# EAGLE design Emulator (EAGLE 9.6.2)

## Sheet 1 of 3: MCU
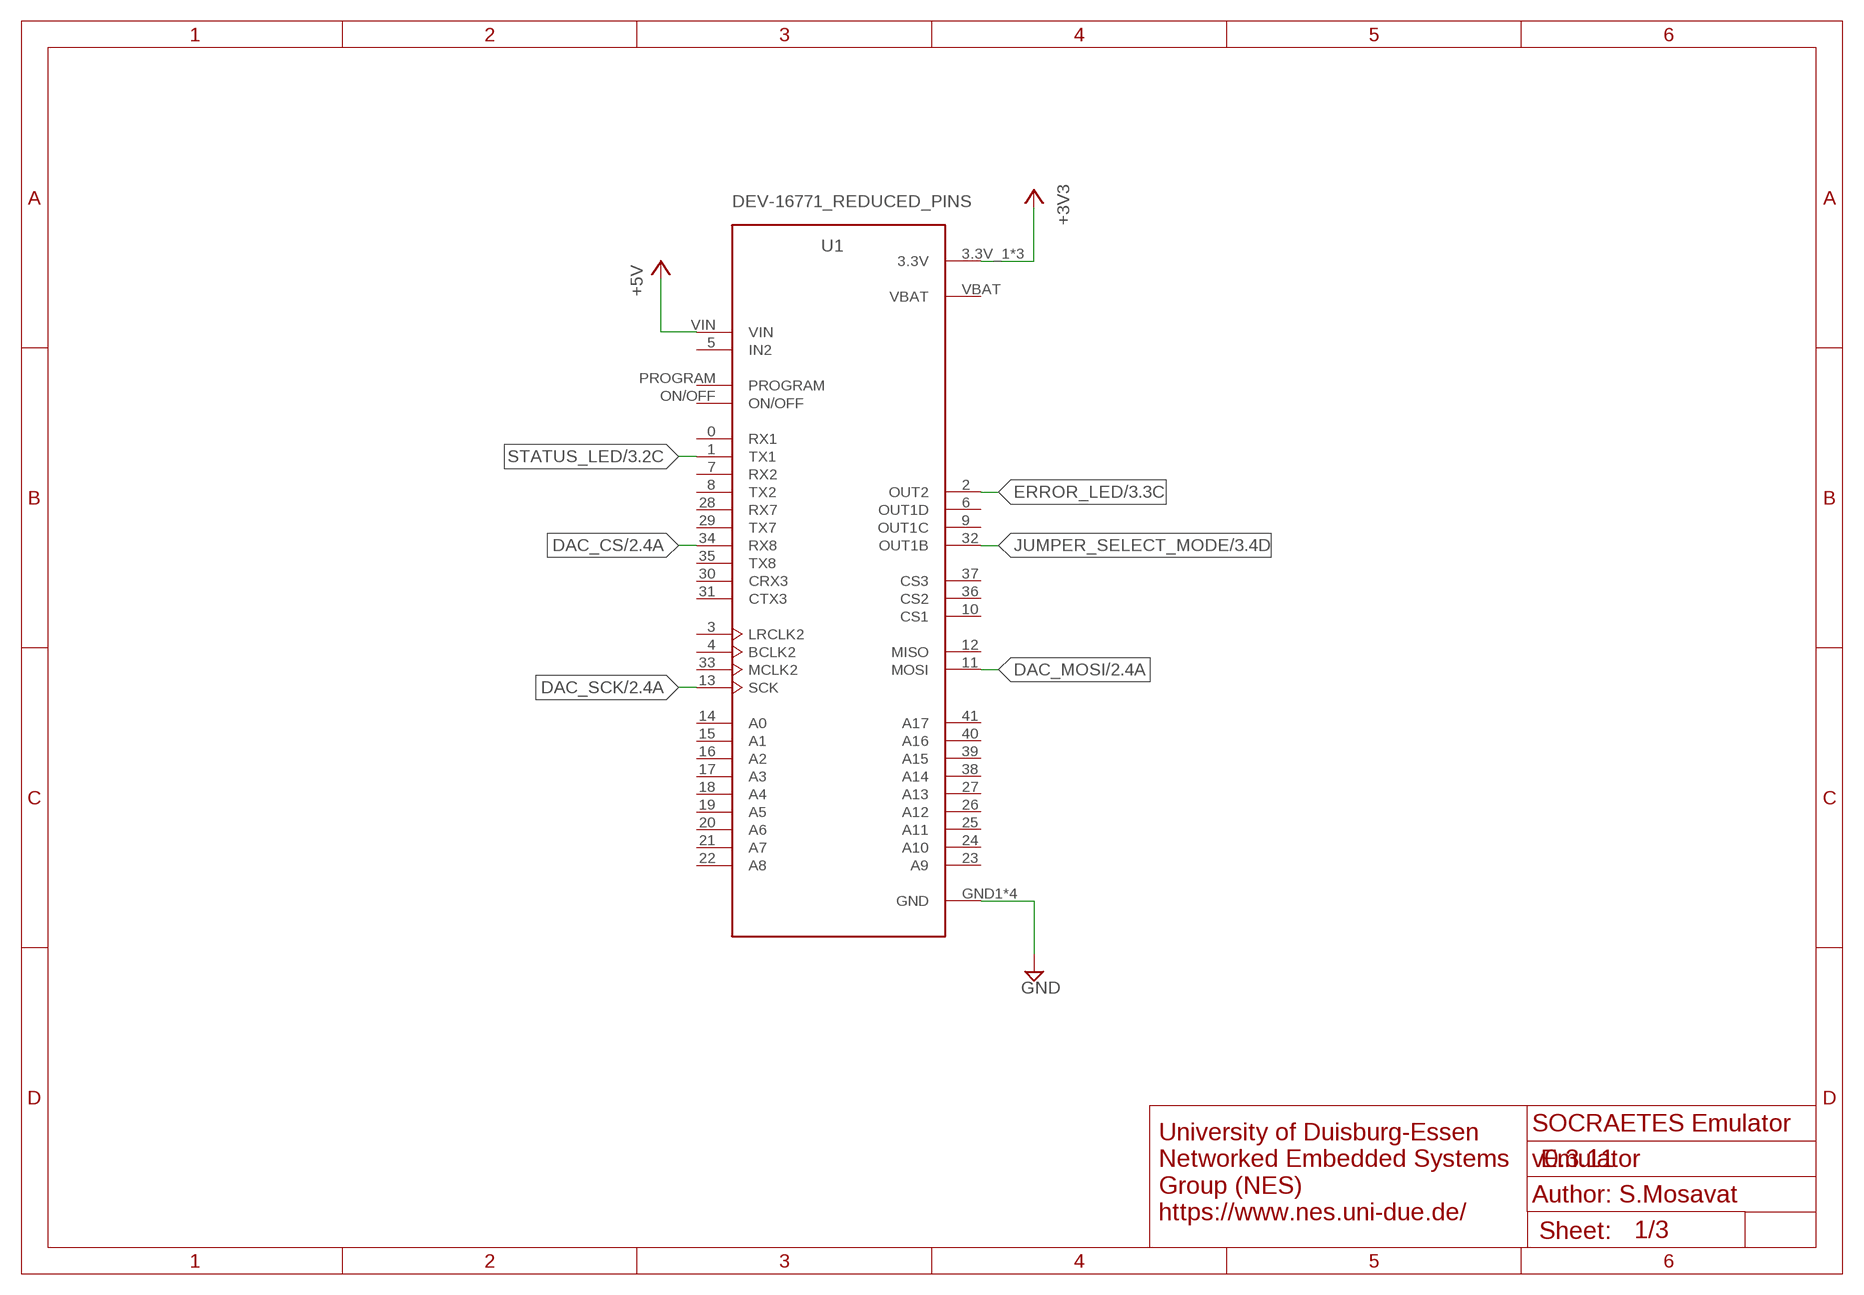
[diagram p0: schematic, sheet 1]

### Parts
U1  DEV-16771_REDUCED_PINS  [MODULE_DEV-16771_REDUCED_PINS]

### Nets
+3V3: U1.3.3V_1(3.3V) U1.3.3V_2(3.3V) U1.3.3V_3(3.3V) ; also sheet 3
+5V: U1.VIN ; also sheet 2,3
DAC_CS: U1.34(RX8) ; also sheet 2
DAC_MOSI: U1.11(MOSI) ; also sheet 2
DAC_SCK: U1.13(SCK) ; also sheet 2
ERROR_LED: U1.2(OUT2) ; also sheet 3
GND: U1.GND1(GND) U1.GND2(GND) U1.GND3(GND) U1.GND4(GND) ; also sheet 2,3
JUMPER_SELECT_MODE: U1.32(OUT1B) ; also sheet 3
STATUS_LED: U1.1(TX1) ; also sheet 3
Unconnected: U1.0(RX1) U1.3(LRCLK2) U1.4(BCLK2) U1.5(IN2) U1.6(OUT1D) U1.7(RX2) U1.8(TX2) U1.9(OUT1C) U1.10(CS1) U1.12(MISO) U1.14(A0) U1.15(A1) U1.16(A2) U1.17(A3) U1.18(A4) U1.19(A5) U1.20(A6) U1.21(A7) U1.22(A8) U1.23(A9) U1.24(A10) U1.25(A11) U1.26(A12) U1.27(A13) U1.28(RX7) U1.29(TX7) U1.30(CRX3) U1.31(CTX3) U1.33(MCLK2) U1.35(TX8) U1.36(CS2) U1.37(CS3) U1.38(A14) U1.39(A15) U1.40(A16) U1.41(A17) U1.ON/OFF U1.PROGRAM U1.VBAT

### Notes on the sheet
- SOCRAETES Emulator
- v0.3.11
- Author: S.Mosavat
- University of Duisburg-Essen
  Networked Embedded Systems
  Group (NES)
  https://www.nes.uni-due.de/

## Sheet 2 of 3: Analog front-end
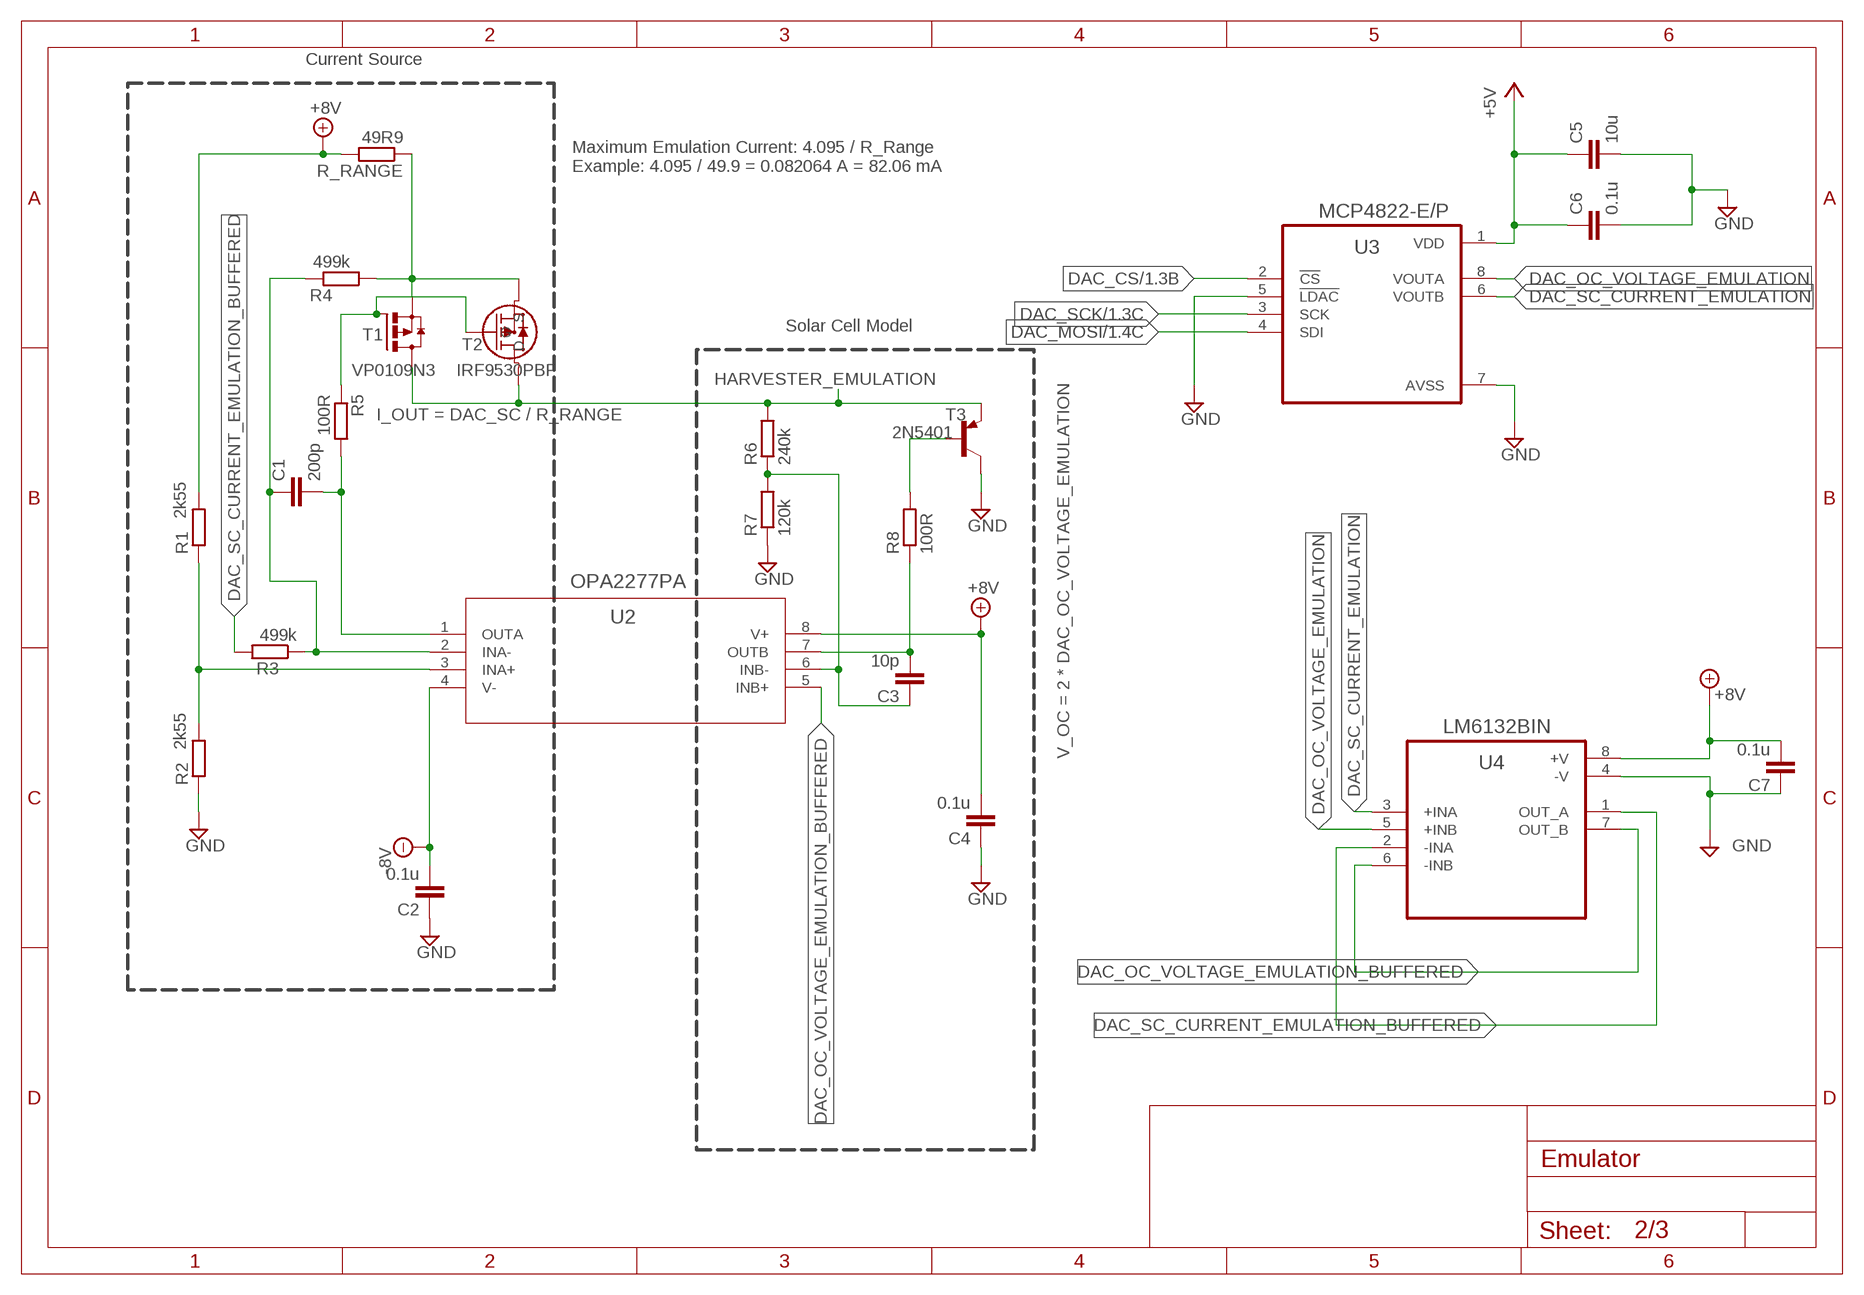
[diagram p1: schematic, sheet 2]

### Parts
C1  200p  C-EU025-024X044  [C025-024X044]
C2  0.1u  C-EU025-024X044  [C025-024X044]
C3  10p  C-EU025-024X044  [C025-024X044]
C4  0.1u  C-EU025-024X044  [C025-024X044]
C5  10u  C-EU025-024X044  [C025-024X044]
C6  0.1u  C-EU025-024X044  [C025-024X044]
C7  0.1u  C-EU025-024X044  [C025-024X044]
R1  2k55  R-EU_0207/10  [0207/10]
R2  2k55  R-EU_0207/10  [0207/10]
R3  499k  R-EU_0207/10  [0207/10]
R4  499k  R-EU_0207/10  [0207/10]
R5  100R  R-EU_0207/10  [0207/10]
R6  240k  R-EU_0207/10  [0207/10]
R7  120k  R-EU_0207/10  [0207/10]
R8  100R  R-EU_0207/10  [0207/10]
R_RANGE  49R9  R-EU_0207/10  [0207/10]
T1  VP0109N3  [TO92-SGD]
T2  IRF9530PBF  [TO220AB_VIS]
T3  2N5401  2N5401-PNP-TO92-EBC  [TO92-EBC]
U2  OPA2277PA  [P8]
U3  MCP4822-E/P  [DIP787W46P254L927H533Q8]
U4  LM6132BIN  [DIP794W45P254L959H508Q8]

### Nets
+5V: C5.1 C6.1 U3.1(VDD) ; also sheet 1,3
+8V: C4.2 C7.2 R1.2 R_RANGE.2 U2.8(V+) U4.8(+V) ; also sheet 3
-8V: C2.2 U2.4(V-) ; also sheet 3
DAC_CS: U3.2(!CS) ; also sheet 1
DAC_MOSI: U3.4(SDI) ; also sheet 1
DAC_OC_VOLTAGE_EMULATION: U3.8(VOUTA) U4.5(+INB)
DAC_OC_VOLTAGE_EMULATION_BUFFERED: U2.5(INB+) U4.6(-INB) U4.7(OUT_B)
DAC_SC_CURRENT_EMULATION: U3.6(VOUTB) U4.3(+INA)
DAC_SC_CURRENT_EMULATION_BUFFERED: R3.2 U4.1(OUT_A) U4.2(-INA)
DAC_SCK: U3.3(SCK) ; also sheet 1
GND: C2.1 C4.1 C5.2 C6.2 C7.1 R2.1 R7.1 T3.C U3.5(!LDAC) U3.7(AVSS) U4.4(-V) ; also sheet 1,3
HARVESTER_EMULATION: R6.2 T1.DRAIN(D) T2.D T3.E ; also sheet 3
N$1: R1.1 R2.2 U2.3(INA+)
N$3: C1.1 R3.1 R4.2 U2.2(INA-)
N$5: R5.1 T1.GATE(G) T2.G
N$6: C1.2 R5.2 U2.1(OUTA)
N$7: R4.1 R_RANGE.1 T1.SOURCE(S) T2.S
N$11: C3.1 R6.1 R7.2 U2.6(INB-)
N$12: R8.2 T3.B
N$13: C3.2 R8.1 U2.7(OUTB)

### Notes on the sheet
- Current Source
- Maximum Emulation Current: 4.095 / R_Range
  Example: 4.095 / 49.9 = 0.082064 A = 82.06 mA
- Solar Cell Model
- I_OUT = DAC_SC / R_RANGE
- V_OC = 2 * DAC_OC_VOLTAGE_EMULATION

## Sheet 3 of 3: Power
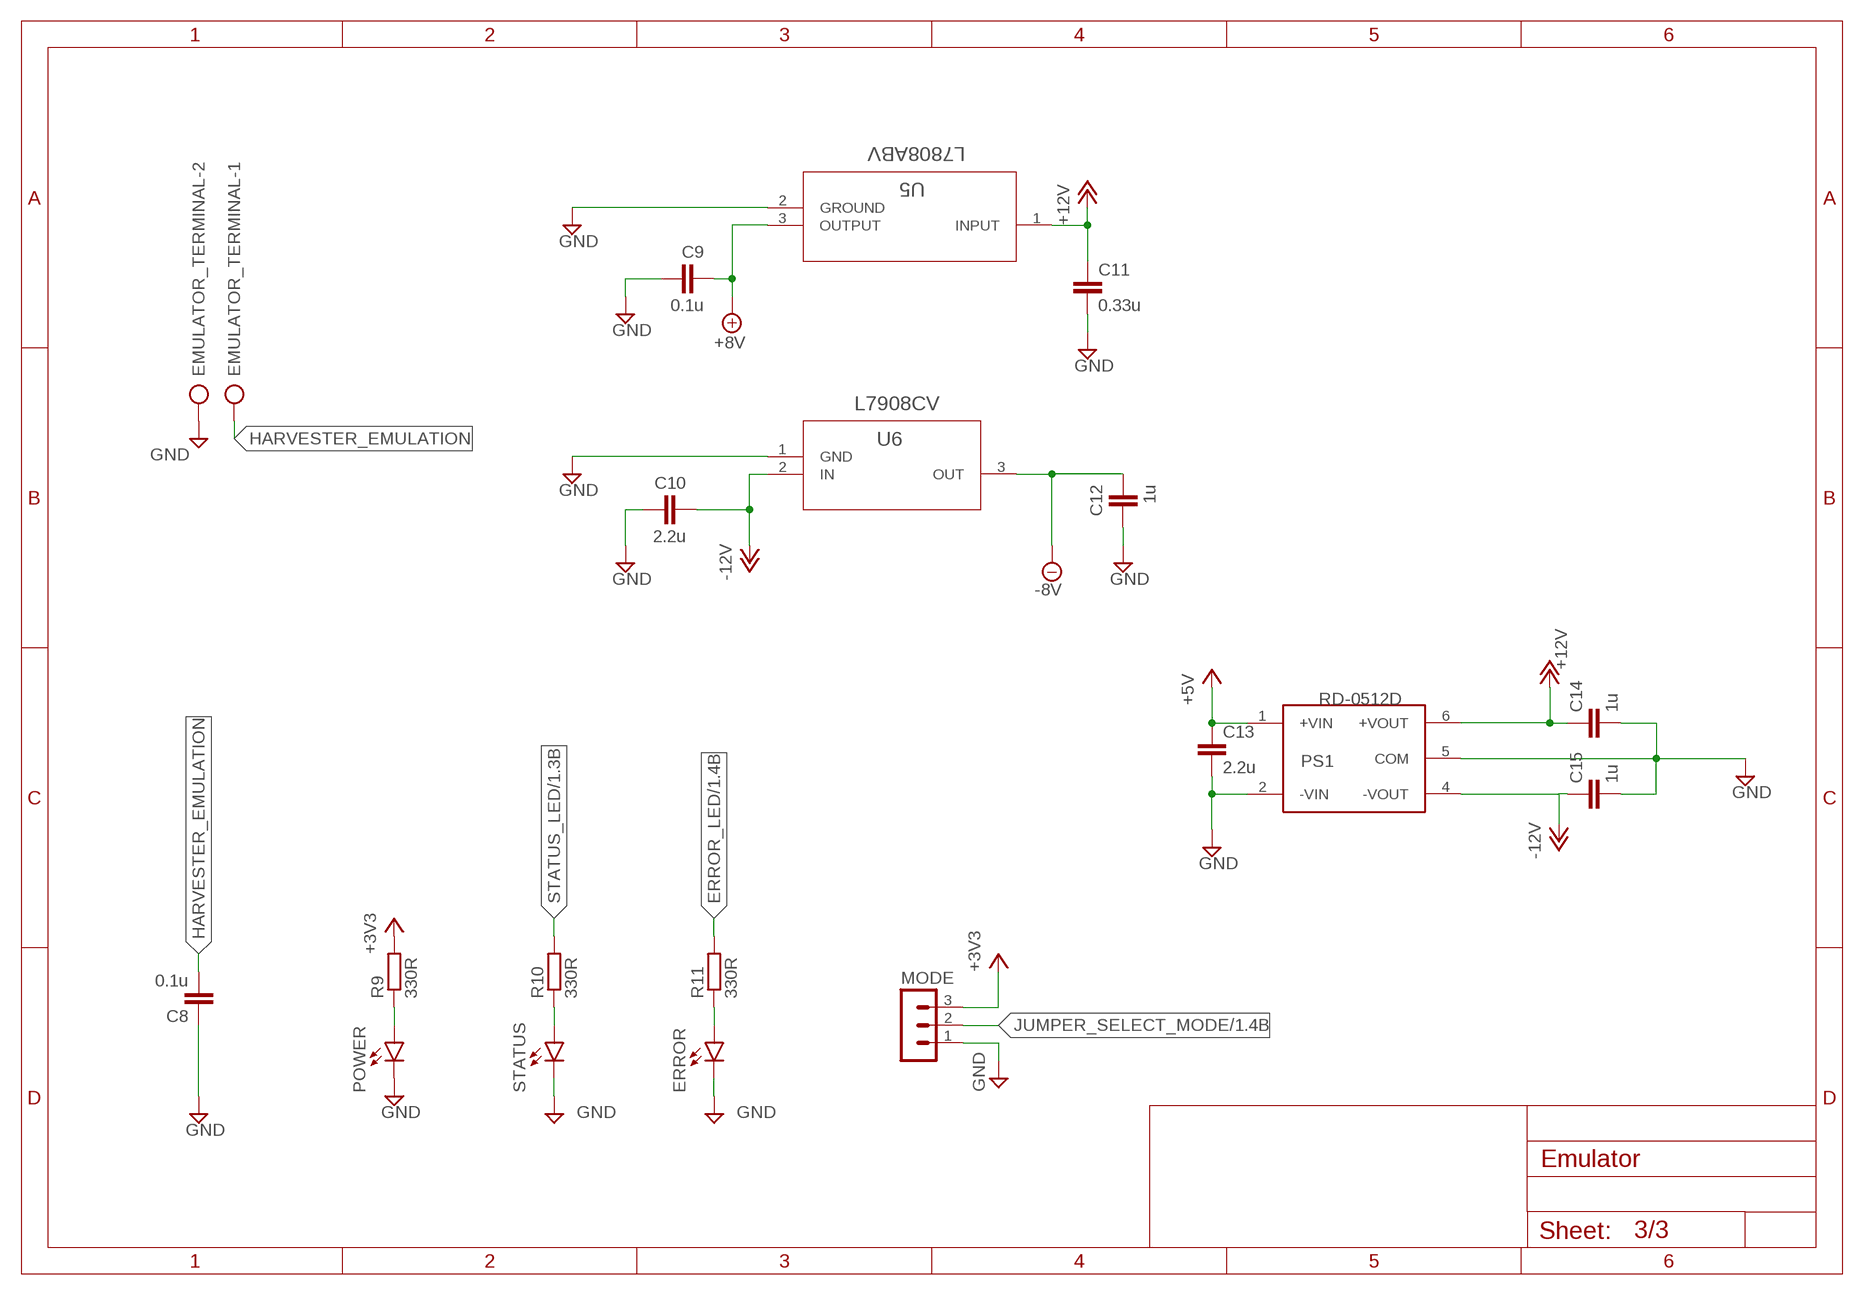
[diagram p2: schematic, sheet 3]

### Parts
C8  0.1u  C-EU025-024X044  [C025-024X044]
C9  0.1u  C-EU025-024X044  [C025-024X044]
C10  2.2u  C-EU025-024X044  [C025-024X044]
C11  0.33u  C-EU025-024X044  [C025-024X044]
C12  1u  C-EU025-024X044  [C025-024X044]
C13  2.2u  C-EU025-024X044  [C025-024X044]
C14  1u  C-EU025-024X044  [C025-024X044]
C15  1u  C-EU025-024X044  [C025-024X044]
EMULATOR_TERMINAL  AK300/2  [AK300/2]
ERROR  LED5MM  [LED5MM]
MODE  MA03-1  [MA03-1]
POWER  LED5MM  [LED5MM]
PS1  RD-0512D  [CONV_RD-0512D]
R9  330R  R-EU_0207/10  [0207/10]
R10  330R  R-EU_0207/10  [0207/10]
R11  330R  R-EU_0207/10  [0207/10]
STATUS  LED5MM  [LED5MM]
U5  L7808ABV  [TO-220_STM]
U6  L7908CV  [TO-220_STM]

### Nets
+3V3: MODE.3 R9.2 ; also sheet 1
+5V: C13.1 PS1.1(+VIN) ; also sheet 1,2
+8V: C9.2 U5.3(OUTPUT) ; also sheet 2
+12V: C11.1 C14.1 PS1.6(+VOUT) U5.1(INPUT)
-8V: C12.2 U6.3(OUT) ; also sheet 2
-12V: C10.2 C15.1 PS1.4(-VOUT) U6.2(IN)
ERROR_LED: R11.2 ; also sheet 1
GND: C8.1 C9.1 C10.1 C11.2 C12.1 C13.2 C14.2 C15.2 EMULATOR_TERMINAL.2 ERROR.K(C) MODE.1 POWER.K(C) PS1.2(-VIN) PS1.5(COM) STATUS.K(C) U5.2(GROUND) U6.1(GND) ; also sheet 1,2
HARVESTER_EMULATION: C8.2 EMULATOR_TERMINAL.1 ; also sheet 2
JUMPER_SELECT_MODE: MODE.2 ; also sheet 1
N$2: R10.1 STATUS.A
N$4: ERROR.A R11.1
N$9: POWER.A R9.1
STATUS_LED: R10.2 ; also sheet 1

## Library data of the parts
C1-C15 = rcl:C-EU: CAPACITOR, European symbol; SPICEPREFIX: C
EMULATOR_TERMINAL = con-ptr500:AK300/2: CONNECTOR; OC_FARNELL: unknown; OC_NEWARK: unknown
ERROR POWER STATUS = led:LED: LED OSRAM: - CHIPLED LG R971, LG N971, LY N971, LG Q971, LY Q971, LO R971, LY R971 LH N974, LH R974 LS Q976, LO Q976, LY Q976 LO Q996 - Hyper CHIPLED LW Q18S LB Q993, LB Q99A, LB R99A - SideLED LS A670, LO A670, LY A670, LG A670, LP A670 LB A673, LV A673, LT A673, LW A673 LH A674 LY A675 LS A676, LA A676, LO A676, LY A676, LW A676 LS A679, LY A679, LG A679 - Hyper Micro SIDELED® LS Y876, LA Y876, LO Y876, LY Y876 LT Y87S - SmartLED LW L88C, LW L88S LB L89C, LB L89S, LG L890 LS L89K, LO L89K, LY L89K LS L896, LA L896, LO L896, LY L896 - TOPLED LS T670, LO T670, LY T670, LG T670, LP T670 LSG T670, LSP T670, LSY T670, LOP T670, LYG T670 LG T671, LOG T671, LSG T671 LB T673, LV T673, LT T673, LW T673 LH T674 LS T676, LA T676, LO T676, LY T676, LB T676, LH T676, LSB T676, LW T676 LB T67C, LV T67C, LT T67C, LS T67K, LO T67K, LY T67K, LW E67C LS E67B, LA E67B, LO E67B, LY E67B, LB E67C, LV E67C, LT E67C LW T67C LS T679, LY T679, LG T679 LS T770, LO T770, LY T770, LG T770, LP T770 LB T773, LV T773, LT T773, LW T773 LH T774 LS E675, LA E675, LY E675, LS T675 LS T776, LA T776, LO T776, LY T776, LB T776 LHGB T686 LT T68C, LB T68C - Hyper Mini TOPLED® LB M676 - Mini TOPLED Santana® LG M470 LS M47K, LO M47K, LY M47K Source: http://www.osram.convergy.de LUXEON: - LUMILED® LXK2-PW12-R00, LXK2-PW12-S00, LXK2-PW14-U00, LXK2-PW14-V00 LXK2-PM12-R00, LXK2-PM12-S00, LXK2-PM14-U00 LXK2-PE12-Q00, LXK2-PE12-R00, LXK2-PE12-S00, LXK2-PE14-T00, LXK2-PE14-U00 LXK2-PB12-K00, LXK2-PB12-L00, LXK2-PB12-M00, LXK2-PB14-N00, LXK2-PB14-P00, LXK2-PB14-Q00 LXK2-PR12-L00, LXK2-PR12-M00, LXK2-PR14-Q00, LXK2-PR14-R00 LXK2-PD12-Q00, LXK2-PD12-R00, LXK2-PD12-S00 LXK2-PH12-R00, LXK2-PH12-S00 LXK2-PL12-P00, LXK2-PL12-Q00, LXK2-PL12-R00 Source: www.luxeon.com KINGBRIGHT: KA-3528ASYC Source: www.kingbright.com
MODE = con-lstb:MA03-1: PIN HEADER; OC_FARNELL: unknown; OC_NEWARK: unknown
PS1 = RD-0512D:RD-0512D: 2 Watt SIP7 Dual Output Check availability <https://pricing.snapeda.com/parts/RD-0512D/Recom%20Power/view-part?ref=eda>; AVAILABILITY: In Stock; DESCRIPTION: 2W DC/DC-Converter 'ECONOLINE' SIP7 1kV unreg; MF: Recom Power; MP: RD-0512D; PACKAGE: SIP-7 Recom Power; PRICE: None; PURCHASE-URL: https://pricing.snapeda.com/search/part/RD-0512D/?ref=eda
R1-R11 R_RANGE = rcl:R-EU_: RESISTOR, European symbol; SPICEPREFIX: R
T1 = ZVP2106A:VP0109N3
T2 = IRF9530PBF:IRF9530PBF; COPYRIGHT: Copyright (C) 2023 Ultra Librarian. All rights reserved.; DIGIKEY_PART_NUMBER_1: IRF9530PBF-ND; MANUFACTURER_PART_NUMBER: IRF9530PBF; MFR_NAME: Vishay
T3 = transistor-neu-to92:*-PNP-: PNP Transistror
U1 = DEV-16771 (Teensy 41):DEV-16771_REDUCED_PINS: RT1062 Teensy 4.1 i.MX ARM Cortex-M7 MPU Embedded Evaluation Board Check availability <https://pricing.snapeda.com/parts/DEV-16771/SparkFun%20Electronics/view-part?ref=eda>
U2 = OPA2277PA:OPA2277PA; DATASHEET_URL: http://www.ti.com/lit/gpn/OPA2277; DESCRIPTION: High Precision Operational Amplifiers; FAMILY_NAME: LOW OFFSET VOLTAGE; GENERIC_PART_NUMBER: OPA2277; INDUSTRY_STD_PKG_TYPE: PDIP; MANUFACTURER: Texas Instruments; MANUFACTURER_PART_NUMBER: OPA2277PA; PACKAGE_DESIGNATOR: P; PIN_COUNT: 8; VENDOR: Texas Instruments
U3 = MCP4822-E_P:MCP4822-E/P: Check availability <https://pricing.snapeda.com/parts/MCP4822-E/P/Microchip/view-part?ref=eda>; AVAILABILITY: In Stock; DESCRIPTION: 12 Bit Digital to Analog Converter 2 8-PDIP; MF: Microchip; MP: MCP4822-E/P; PACKAGE: DIP-8 Microchip; PRICE: None; PURCHASE-URL: https://pricing.snapeda.com/search/part/MCP4822-E/P/?ref=eda
U4 = LM6132BIN:LM6132BIN; DESCRIPTION: Dual Low Power 10 MHz Rail-to-Rail I/O Operational Amplifier 8-PDIP -40 to 85; DIGI-KEY_PART_NUMBER: LM6132BIN/NOPB-ND; MF: Texas Instruments; MP: LM6132BIN/NOPB; PACKAGE: PDIP-8 Texas; PURCHASE-URL: https://pricing.snapeda.com/search/part/LM6132BIN/NOPB/?ref=eda
U5 = L7808ABV:L7808ABV; BUILT_BY: EMA_UL_Team; MANUFACTURER_PART_NUMBER: L7808ABV; SOURCELIBRARY: Updates_to_database_2020-11-10; VENDOR: STMicroelectronics
U6 = L7908CV:L7908CV; BUILT_BY: EMA_UL_Team; MANUFACTURER_PART_NUMBER: L7908CV; SOURCELIBRARY: Updates_to_database_2020-11-13; VENDOR: STMicroelectronics

## Board
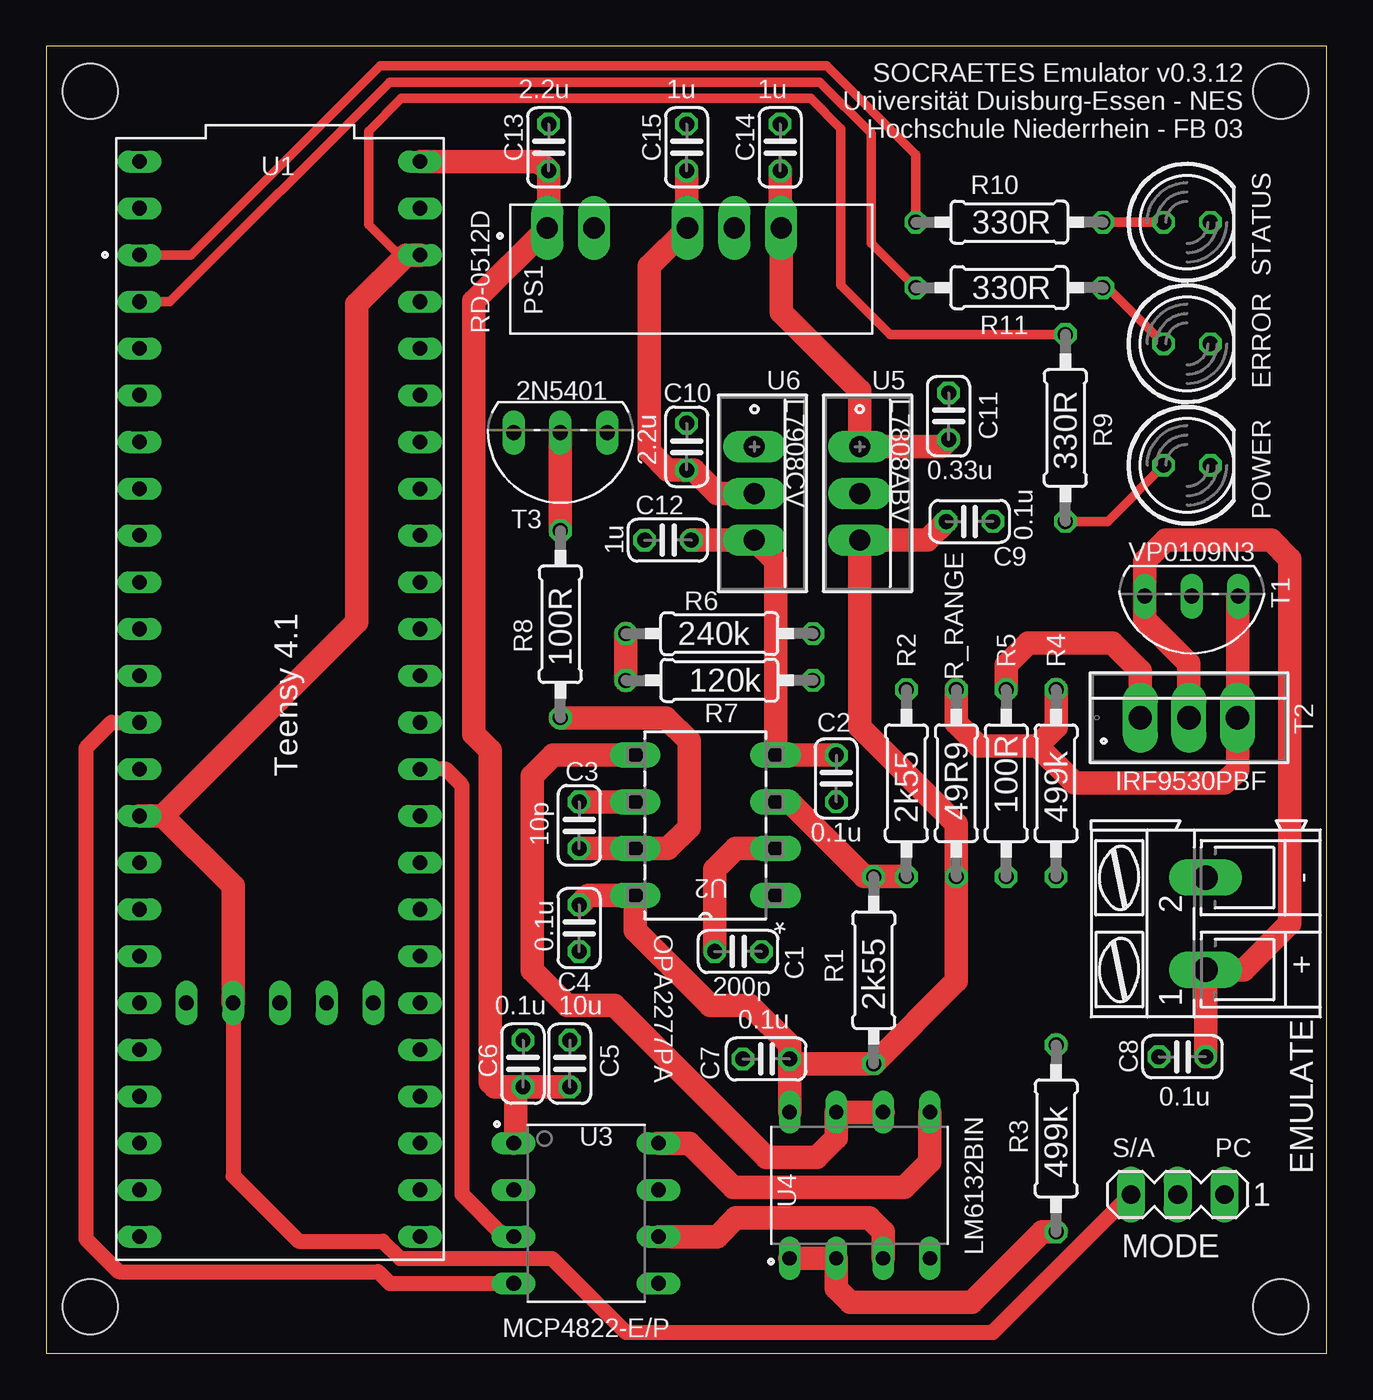
[diagram p3: board, top side]
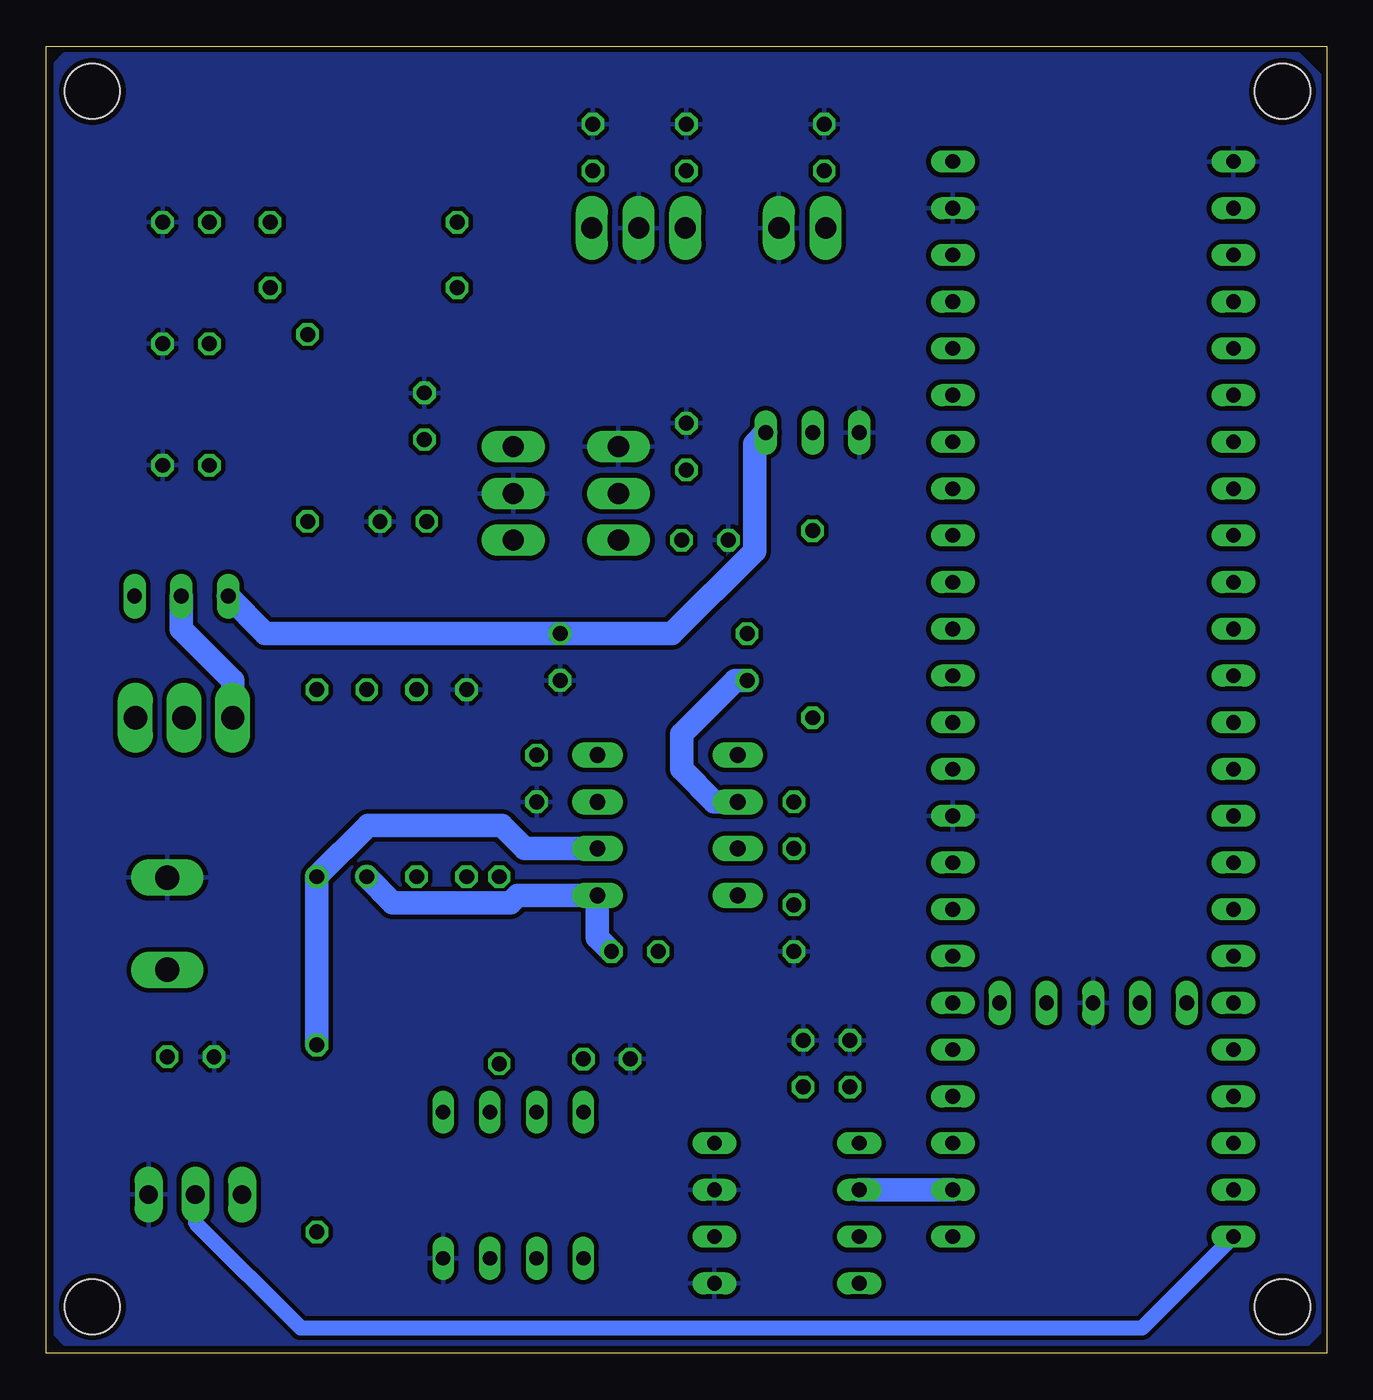
[diagram p4: board, bottom side, seen from below]

Size 69.58 x 71.04 mm. Coordinates in mm from the lower left corner, seen from the top.
Outline: 0,0 69.58,0 69.58,71.04 0,71.04 0,0
Copper layers (1*16): Top 0.035mm / dielectric 1.5mm / Bottom 0.035mm
Design rules "aisler_2_layer_simple *": minimum track width 0.2mm, minimum drill 0.45mm, track to track 0.25mm, track to pad 0.175mm, pad to pad 0.175mm, via to via 0.175mm, smd to smd 0.175mm, copper to edge 0.3mm, drill to drill 0.25mm, minimum pad ring 0.2mm, minimum via ring 0.2mm, stop-mask expansion 0mil, vias tented up to drill 50mil, thermal gap 10mil
Holes 3 mm at 67.06,68.58 2.41,68.58 2.41,2.54 67.06,2.54

### Footprints (pad centres in the part's own frame; a part is rotated, then mirrored left to right if it is on the bottom)
C025-024X044 = drill 0.813 octagon: 1 -1.27,0; 2 1.27,0
AK300/2 = drill 1.321 long: 1 -2.515,0; 2 2.489,0
LED5MM = drill 0.813 octagon: A -1.27,0; K 1.27,0
MA03-1 = drill 1.016 long: 1 -2.54,0; 2 0,0; 3 2.54,0
CONV_RD-0512D = drill 1.15 pad 1.676 long: 1 -7.825,2.23; 2 -5.285,2.23; 4 -0.205,2.23; 5 2.335,2.23; 6 4.875,2.23
0207/10 = drill 0.813 octagon: 1 -5.08,0; 2 5.08,0
TO92-SGD = drill 0.813 long: DRAIN 2.54,0; GATE 0,0; SOURCE -2.54,0
TO220AB_VIS = drill 1.27 pad 1.778 long: D 2.642,0; G 0,0; S 5.283,0
TO92-EBC = drill 0.813 long: B 0,-1.27; C 2.54,-1.27; E -2.54,-1.27
MODULE_DEV-16771_REDUCED_PINS = drill 0.8 pad 1.143 long: 0 -26.67,-7.62; 1 -24.13,-7.62; 2 -21.59,-7.62; 3 -19.05,-7.62; 3.3V_1 6.35,-7.62; 3.3V_2 -24.13,7.62; 3.3V_3 16.51,-2.54; 4 -16.51,-7.62; 5 -13.97,-7.62; 6 -11.43,-7.62; 7 -8.89,-7.62; 8 -6.35,-7.62; 9 -3.81,-7.62; 10 -1.27,-7.62; 11 1.27,-7.62; 12 3.81,-7.62; 13 3.81,7.62; 14 1.27,7.62; 15 -1.27,7.62; 16 -3.81,7.62; 17 -6.35,7.62; 18 -8.89,7.62; 19 -11.43,7.62; 20 -13.97,7.62; 21 -16.51,7.62; 22 -19.05,7.62; 23 -21.59,7.62; 24 8.89,-7.62; 25 11.43,-7.62; 26 13.97,-7.62; 27 16.51,-7.62; 28 19.05,-7.62; 29 21.59,-7.62; 30 24.13,-7.62; 31 26.67,-7.62; 32 29.21,-7.62; 33 29.21,7.62; 34 26.67,7.62; 35 24.13,7.62; 36 21.59,7.62; 37 19.05,7.62; 38 16.51,7.62; 39 13.97,7.62; 40 11.43,7.62; 41 8.89,7.62; GND1 -29.21,-7.62; GND2 6.35,7.62; GND3 -26.67,7.62; GND4 16.51,0; ON/OFF 16.51,5.08; PROGRAM 16.51,2.54; VBAT 16.51,-5.08; VIN -29.21,7.62
P8 = drill 0.864 pad 1.372 long: 1 -7.62,7.62; 2 -7.62,5.08; 3 -7.62,2.54; 4 -7.62,0; 5 0,0; 6 0,2.54; 7 0,5.08; 8 0,7.62
DIP787W46P254L927H533Q8 = drill 0.8 pad 1.143 long: 1 -3.935,3.81; 2 -3.935,1.27; 3 -3.935,-1.27; 4 -3.935,-3.81; 5 3.935,-3.81; 6 3.935,-1.27; 7 3.935,1.27; 8 3.935,3.81
DIP794W45P254L959H508Q8 = drill 0.78 pad 1.143 long: 1 -3.97,3.81; 2 -3.97,1.27; 3 -3.97,-1.27; 4 -3.97,-3.81; 5 3.97,-3.81; 6 3.97,-1.27 | drill 0.78 pad 1.13 long: 7 3.97,1.27; 8 3.97,3.81
TO-220_STM = drill 1.143 pad 1.651 long: 1 0,0; 2 2.54,0; 3 5.08,0

### Placement (x,y rotation side)
C1  37.59,21.84 0 top
C2  42.93,31.24 90 top
C3  28.96,28.7 270 top
C4  28.96,23.11 90 top
C5  28.45,15.75 90 top
C6  25.91,15.75 90 top
C7  39.12,16 0 top
C8  61.72,16.13 0 top
C9  50.16,45.21 180 top
C10  34.8,49.28 270 top
C11  49.02,50.93 90 top
C12  33.78,44.2 0 top
C13  27.3,65.53 90 top
C14  39.88,65.53 90 top
C15  34.8,65.53 90 top
EMULATOR_TERMINAL  62.99,23.37 90 top
ERROR  61.98,54.86 0 top
MODE  61.47,8.64 180 top
POWER  61.98,48.26 0 top
PS1  35.05,58.93 0 top
R1  44.96,20.83 270 top
R2  46.74,30.99 270 top
R3  54.86,11.68 270 top
R4  54.86,30.99 270 top
R5  52.15,30.99 270 top
R6  36.58,39.12 0 top
R7  36.58,36.58 180 top
R8  27.94,39.62 90 top
R9  55.37,50.29 90 top
R10  52.32,61.47 180 top
R11  52.32,57.91 180 top
R_RANGE  49.45,30.99 270 top
STATUS  61.98,61.47 0 top
T1  62.23,41.15 180 top
T2  59.44,34.54 0 top
T3  27.94,48.77 180 top
U1  12.7,35.56 270 top
U2  32,32.51 180 top
U3  29.34,7.62 0 top
U4  44.2,9.14 90 top
U5  44.2,49.28 270 top
U6  38.48,49.28 270 top

### Tracks (layer width: path | path; a pad name or v marks a point on that pad's centre or on a via)
+3V3
  Top 0.508: 19.18,59.69 17.53,61.34 17.53,66.42 19.3,68.2 41.53,68.2 43.18,66.55 43.18,58.04 45.85,55.37 R9.2
  Top 0.813: 19.18,59.69 U1.3.3V_2 | MODE.3 51.44,1.14 31.5,1.14 27.47,5.17 19.23,5.17 18.3,6.1 13.72,6.1 10.16,9.65 U1.3.3V_3
  Top 1.27: U1.3.3V_1 6.35,29.21 | U1.3.3V_3 10.16,25.4 6.35,29.21 | 6.35,29.21 16.89,39.75 16.89,57.02 19.56,59.69 U1.3.3V_2
+5V
  Top 1.27: U1.VIN 26.8,64.77 C13.1 27.3,61.24 PS1.1 23.24,57.17 23.24,33.66 24.13,32.77 24.13,14.73 24.38,14.48 C6.1 | C6.1 25.53,14.1 25.53,11.55 U3.1 | C5.1 C6.1
+8V
  Top 1.27: C9.2 47.88,44.2 U5.3 44.2,34.04 49.45,28.79 R_RANGE.2 49.45,20.23 R1.2 40.64,15.75 C7.2 | C4.2 29.46,24.89 U2.8 32,22.99 36.07,18.92 38.23,18.92 40.39,16.76 C7.2 | C7.2 U4.8
+12V
  Top 1.27: C14.1 39.88,61.21 PS1.6 39.93,56.59 44.2,52.32 U5.1 48.64,49.28 C11.1
-8V
  Top 1.27: C12.2 U6.3 39.62,43.05 U2.4 C2.2
-12V
  Top 1.27: C15.1 34.8,61.21 PS1.4 32.77,59.08 32.77,49.02 33.78,48.01 C10.2 35.18,48.01 36.45,46.74 U6.2
DAC_CS
  Bottom 1.27: U1.34 U3.2
DAC_MOSI
  Top 0.813: U1.11 3.56,34.29 2.16,32.89 2.16,6.22 3.94,4.45 18.03,4.45 18.67,3.81 U3.4
DAC_OC_VOLTAGE_EMULATION
  Top 1.27: U3.8 34.93,11.43 37.34,9.02 46.61,9.02 48.01,10.41 U4.5
DAC_OC_VOLTAGE_EMULATION_BUFFERED
  Top 1.27: U4.6 U4.7 42.93,11.72 41.88,10.67 39.12,10.67 30.86,18.92 28.32,18.92 26.42,20.83 26.42,31.37 27.56,32.51 U2.5
DAC_SC_CURRENT_EMULATION
  Top 1.27: U3.6 36.45,6.35 37.47,7.37 44.7,7.37 45.47,6.6 U4.3
DAC_SC_CURRENT_EMULATION_BUFFERED
  Top 1.27: U4.1 U4.2 42.93,3.56 43.69,2.79 50.29,2.79 54.1,6.6 R3.2
DAC_SCK
  Top 0.813: U3.3 24.89,6.35 22.61,8.64 22.61,30.86 21.72,31.75 U1.13
ERROR_LED
  Top 0.508: U1.2 6.73,57.15 18.67,69.09 42.04,69.09 44.83,66.29 44.83,60.33 R11.2
GND
  pour Bottom: 1.52,70.61 68.58,70.61 69.09,70.1 69.09,1.02 68.58,0.51 1.02,0.51 0.25,1.27 0.25,69.34
HARVESTER_EMULATION
  Top 1.27: C8.2 EMULATOR_TERMINAL.1 65.05,20.85 67.56,23.37 67.56,43.18 66.55,44.2 60.83,44.2 59.69,43.05 T1.DRAIN 59.69,39.88 62.08,37.49 T2.D
  Bottom 1.27: T3.E 31.09,49.43 31.09,43.61 35.58,39.12 R6.2 57.66,39.12 T1.DRAIN
JUMPER_SELECT_MODE
  Bottom 0.813: MODE.2 61.47,7.11 55.75,1.4 10.03,1.4 U1.32
N$1
  Top 1.27: R2.2 R1.1 44.45,25.91 40.39,29.97 U2.3
N$2
  Top 0.508: R10.1 STATUS.A
N$3
  Top 1.27: C1.1 36.32,26.29 37.47,27.43 U2.2 | R3.1
  Bottom 1.27: U2.2 43.56,27.43 44.83,28.7 52.07,28.7 R4.2 | R3.1 R4.2 | R4.2
N$4
  Top 0.508: R11.1 57.66,57.91 ERROR.A
N$5
  Top 1.27: R5.1 52.16,37.42 53.34,38.61 57.91,38.61 59.44,37.08 T2.G
  Bottom 1.27: T2.G 59.44,36.58 62.23,39.37 T1.GATE
N$6
  Bottom 1.27: R5.2 50.73,24.49 44.37,24.49 43.97,24.89 U2.1 39.62,22.61 C1.2
N$7
  Top 1.27: R_RANGE.1 49.45,34.25 50.67,33.02 53.85,33.02 | 53.85,33.02 54.86,34.04 R4.1 | R4.1 | T1.SOURCE 64.72,41.1 T2.S 64.72,31.7 64.01,30.99 55.88,30.99 53.85,33.02
N$9
  Top 0.508: R9.1 57.66,45.21 POWER.A
N$11
  Top 1.27: C3.1 U2.6 | R7.2 R6.1
  Bottom 1.27: R7.2 32.13,36.58 35.05,33.66 35.05,31.75 33.27,29.97 U2.6
N$12
  Top 1.27: T3.B R8.2
N$13
  Top 1.27: C3.2 U2.7 33.78,27.43 34.93,28.57 34.93,33.27 33.66,34.54 R8.1
STATUS_LED
  Top 0.508: U1.1 7.87,59.69 18.16,69.98 42.42,69.98 47.24,65.15 R10.2

### Text on the board
tNames: SOCRAETES Emulator v0.3.12 / Universität Duisburg-Essen - NES / Hochschule Niederrhein - FB 03 | S/A | PC | EMULATE + -